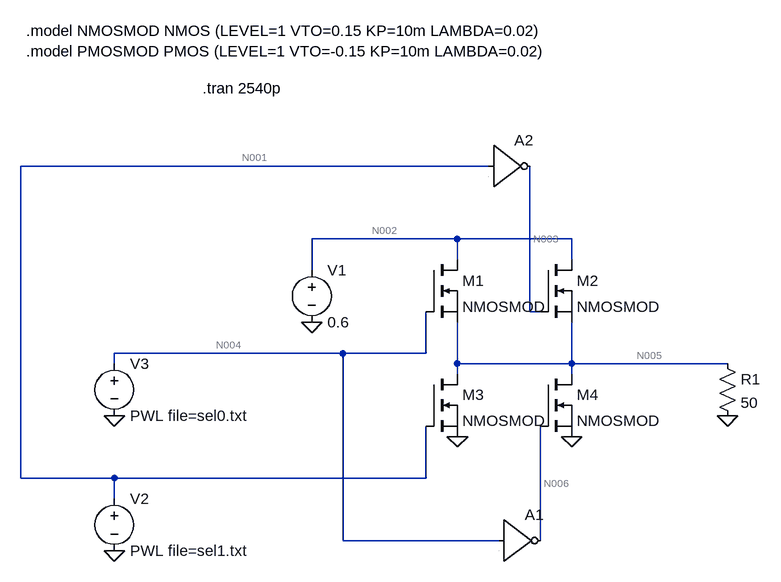
[diagram p0: schematic pam3_driver.asc]
pam3_driver.asc, the LTspice schematic file:
Version 4
SHEET 1 5644 1652
WIRE 192 -192 -528 -192
WIRE 144 -80 -80 -80
WIRE 320 -80 144 -80
WIRE 144 -48 144 -80
WIRE 320 -48 320 -80
WIRE -80 -32 -80 -80
WIRE 256 32 256 -192
WIRE 272 32 256 32
WIRE -32 96 -384 96
WIRE 96 96 96 32
WIRE 96 96 -32 96
WIRE -384 112 -384 96
WIRE 144 112 144 48
WIRE 320 112 320 48
WIRE 320 112 144 112
WIRE 560 112 320 112
WIRE 144 128 144 112
WIRE 320 128 320 112
WIRE -528 288 -528 -192
WIRE -384 288 -528 288
WIRE 96 288 96 208
WIRE 96 288 -384 288
WIRE -384 320 -384 288
WIRE -32 384 -32 96
WIRE 208 384 -32 384
WIRE 272 384 272 208
FLAG -80 48 0
FLAG 144 224 0
FLAG 320 224 0
FLAG -384 192 0
FLAG -384 400 0
FLAG 560 192 0
SYMBOL voltage -80 -48 R0
WINDOW 123 0 0 Left 0
WINDOW 39 0 0 Left 0
SYMATTR InstName V1
SYMATTR Value 0.6
SYMBOL nmos 96 -48 R0
SYMATTR InstName M1
SYMATTR Value NMOSMOD
SYMBOL nmos 272 -48 R0
SYMATTR InstName M2
SYMATTR Value NMOSMOD
SYMBOL nmos 96 128 R0
SYMATTR InstName M3
SYMATTR Value NMOSMOD
SYMBOL nmos 272 128 R0
SYMATTR InstName M4
SYMATTR Value NMOSMOD
SYMBOL voltage -384 96 R0
WINDOW 123 0 0 Left 0
WINDOW 39 0 0 Left 0
SYMATTR InstName V3
SYMATTR Value PWL file=sel0.txt
SYMBOL voltage -384 304 R0
WINDOW 123 0 0 Left 0
WINDOW 39 0 0 Left 0
SYMATTR InstName V2
SYMATTR Value PWL file=sel1.txt
SYMBOL res 544 96 R0
SYMATTR InstName R1
SYMATTR Value 50
SYMBOL Digital\\inv 208 320 R0
SYMATTR InstName A1
SYMBOL Digital\\inv 192 -256 R0
SYMATTR InstName A2
TEXT -248 -312 Left 2 !.tran 2540p
TEXT -520 -400 Left 2 !.model NMOSMOD NMOS (LEVEL=1 VTO=0.15 KP=10m LAMBDA=0.02)\n.model PMOSMOD PMOS (LEVEL=1 VTO=-0.15 KP=10m LAMBDA=0.02)

The netlist it stands for:
* pam3_driver.asc
V1 N002 0 0.6
M1 N002 N004 N005 N005 NMOSMOD
M2 N002 N003 N005 N005 NMOSMOD
M3 N005 N001 0 0 NMOSMOD
M4 N005 N006 0 0 NMOSMOD
V3 N004 0 PWL file=sel0.txt
V2 N001 0 PWL file=sel1.txt
R1 N005 0 50
A1 N004 0 0 0 0 N006 0 0 BUF
A2 N001 0 0 0 0 N003 0 0 BUF
.model NMOS NMOS
.model PMOS PMOS
.lib standard.mos
.tran 2540p
.model NMOSMOD NMOS (LEVEL=1 VTO=0.15 KP=10m LAMBDA=0.02)
.model PMOSMOD PMOS (LEVEL=1 VTO=-0.15 KP=10m LAMBDA=0.02)
.backanno
.end

* Results of the author's LTspice run, read from the files saved beside the schematic
* Operating Point, zero values left out:
*   V(n002) = 600 mV
*   V(n005) = 92.15 mV
*   V(n003) = 1 V
*   V(n006) = 1 V
*   Id(M1) = 1.026 pA
*   Id(M2) = 2.585 mA
*   Is(M2) = -2.585 mA
*   Id(M4) = 742.2 µA
*   Is(M4) = -742.2 µA
*   I(R1) = 1.843 mA
*   I(V1) = -2.585 mA
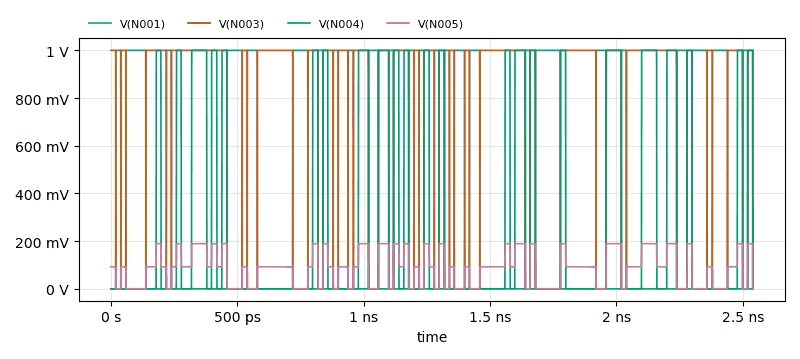
[diagram p1: Transient Analysis of pam3_driver.asc, plotted from the saved traces]
* Transient Analysis, 1 run:
*   V(N001): min 0 V, max 1 V, average 361.2 mV, rms 598.5 mV, last 1 V
*   V(N003): min 0 V, max 1 V, average 638.8 mV, rms 799.2 mV, last 0 V
*   V(N004): min 0 V, max 1 V, average 261.8 mV, rms 509 mV, last 0 V
*   V(N005): min -413 nV, max 188.8 mV, average 83.98 mV, rms 111.5 mV, last 0 V